# EAGLE design Board5 (EAGLE 6.1)
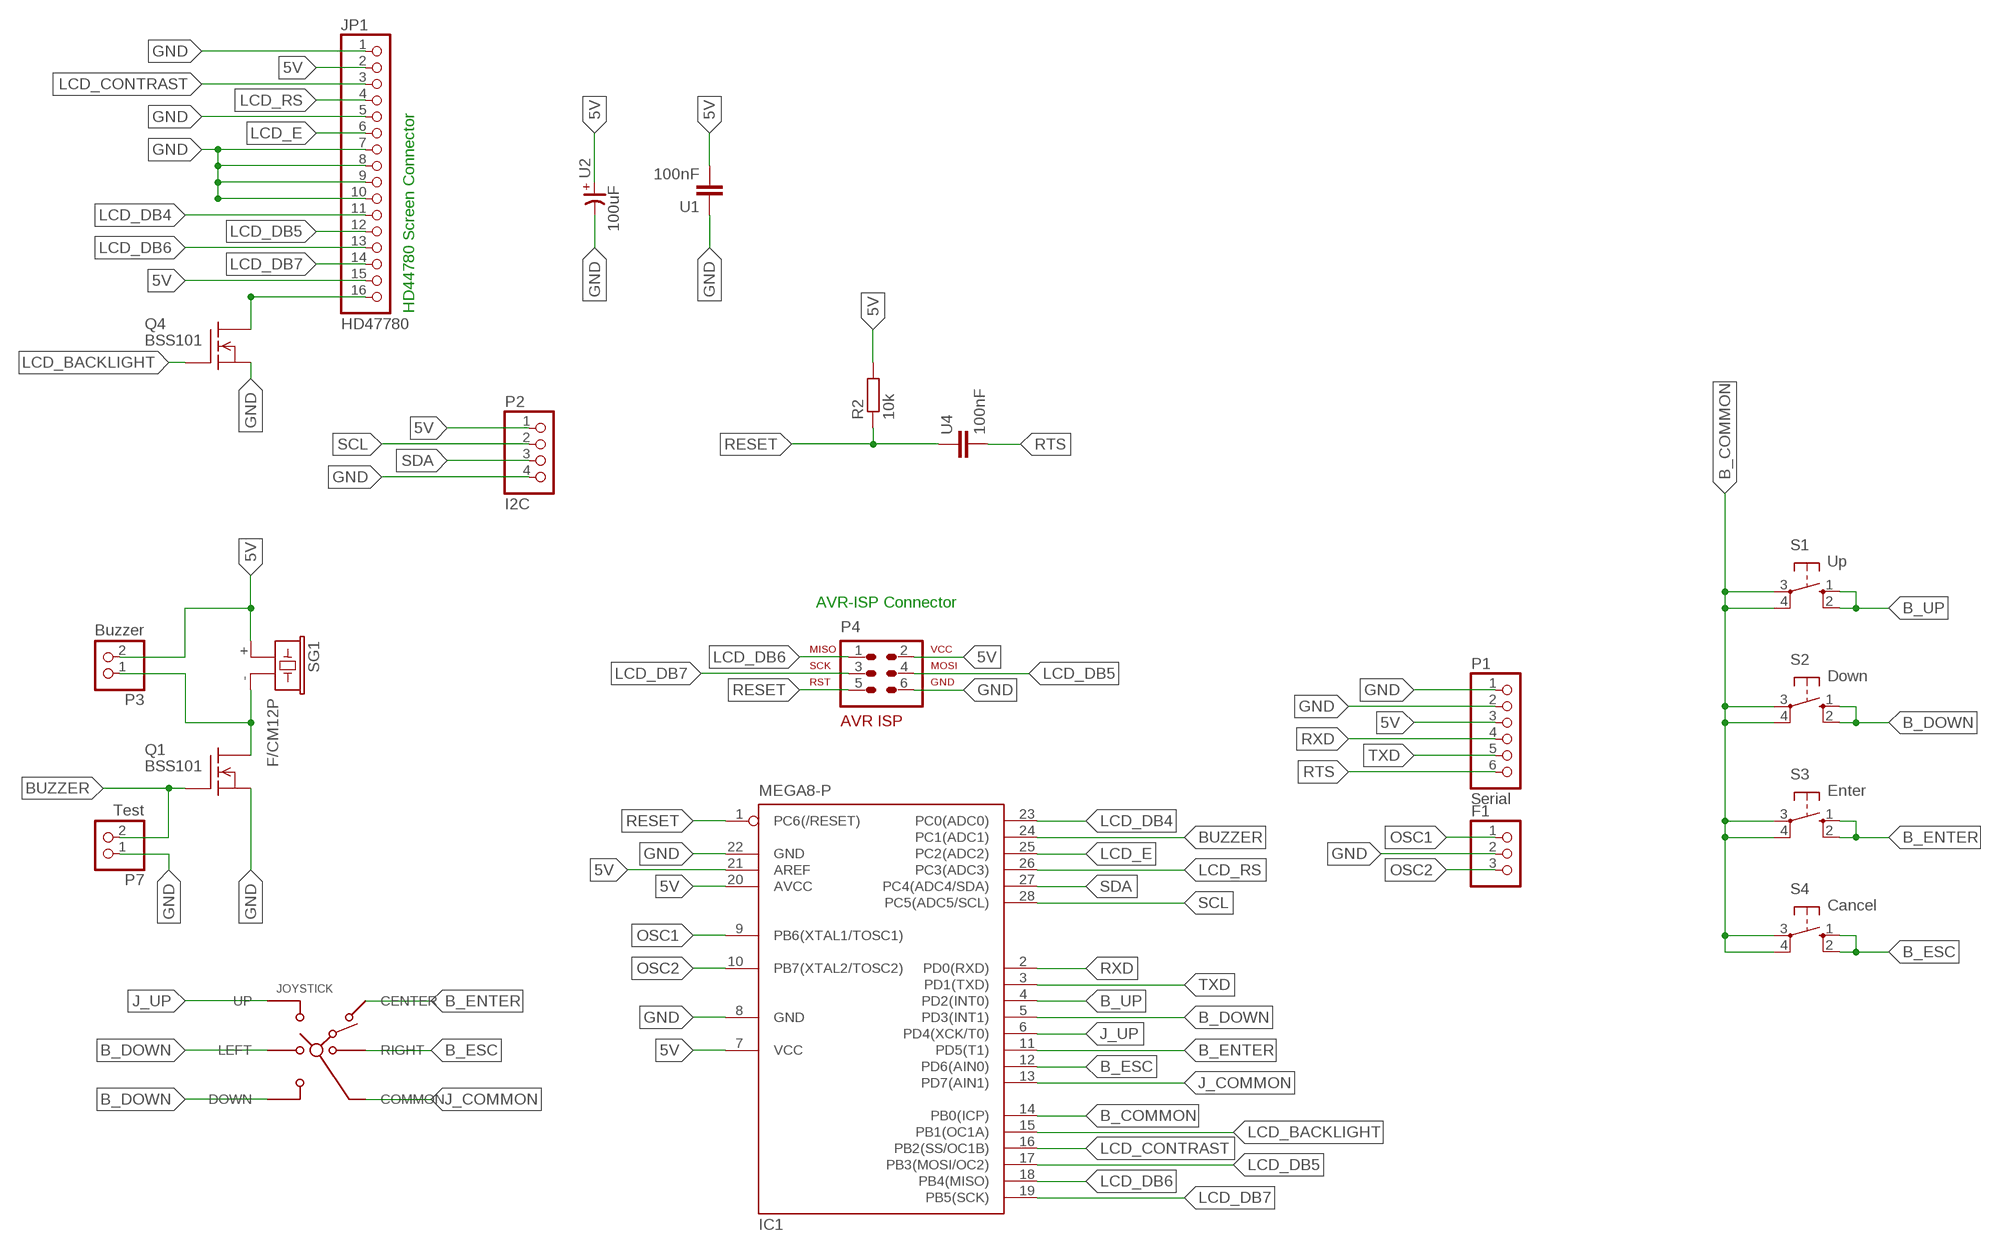
[diagram p0: schematic, sheet 1]

## Parts
F1  PINHD-1X3  [1X03]
IC1  MEGA8-P  [DIL28-3]
JOYSTICK  SKQUAAA010  [SKQU]
JP1  HD47780  PINHD-1X16  [1X16]
P1  Serial  PINHD-1X6  [1X06]
P2  I2C  PINHD-1X4  [1X04]
P3  Buzzer  PINHD-1X2  [1X02]
P4  ISP_WANNENBUCHSE  [ML6]
P7  Test  PINHD-1X2  [1X02]
Q1  BSS101  [TO92]
Q4  BSS101  [TO92]
R2  10k  R-EU_0207/10  [0207/10]
S1  Up  40-XX  [B3F-40XX]
S2  Down  40-XX  [B3F-40XX]
S3  Enter  40-XX  [B3F-40XX]
S4  Cancel  40-XX  [B3F-40XX]
SG1  F/CM12P  [F/CM12P]
U1  100nF  C-EU050-024X044  [C050-024X044]
U2  100uF  CP-E-020X050  [E-020X050]
U4  100nF  C-EU050-024X044  [C050-024X044]

## Nets
5V: IC1.7(VCC) IC1.20(AVCC) IC1.21(AREF) JP1.2 JP1.15 P1.3 P2.1 P3.2 P4.2(VCC) R2.2 SG1.+ U1.2 U2.+
B_COMMON: IC1.14(PB0(ICP)) S1.3(P) S1.4(P1) S2.3(P) S2.4(P1) S3.3(P) S3.4(P1) S4.3(P) S4.4(P1)
B_DOWN: IC1.5(PD3(INT1)) JOYSTICK.DOWN JOYSTICK.LEFT S2.1(S) S2.2(S1)
B_ENTER: IC1.11(PD5(T1)) JOYSTICK.CENTER S3.1(S) S3.2(S1)
B_ESC: IC1.12(PD6(AIN0)) JOYSTICK.RIGHT S4.1(S) S4.2(S1)
B_UP: IC1.4(PD2(INT0)) S1.1(S) S1.2(S1)
BUZZER: IC1.24(PC1(ADC1)) P7.2 Q1.2(G)
GND: F1.2 IC1.8(GND) IC1.22(GND) JP1.1 JP1.5 JP1.7 JP1.8 JP1.9 JP1.10 P1.1 P1.2 P2.4 P4.6(GND) P7.1 Q1.1(S) Q4.1(S) U1.1 U2.-
J_COMMON: IC1.13(PD7(AIN1)) JOYSTICK.COMMON
J_UP: IC1.6(PD4(XCK/T0)) JOYSTICK.UP
LCD_BACKLIGHT: IC1.15(PB1(OC1A)) Q4.2(G)
LCD_CONTRAST: IC1.16(PB2(SS/OC1B)) JP1.3
LCD_DB4: IC1.23(PC0(ADC0)) JP1.11
LCD_DB5: IC1.17(PB3(MOSI/OC2)) JP1.12 P4.4(MOSI)
LCD_DB6: IC1.18(PB4(MISO)) JP1.13 P4.1(MISO)
LCD_DB7: IC1.19(PB5(SCK)) JP1.14 P4.3(SCK)
LCD_E: IC1.25(PC2(ADC2)) JP1.6
LCD_RS: IC1.26(PC3(ADC3)) JP1.4
N$2: JP1.16 Q4.3(D)
N$4: P3.1 Q1.3(D) SG1.-
OSC1: F1.1 IC1.9(PB6(XTAL1/TOSC1))
OSC2: F1.3 IC1.10(PB7(XTAL2/TOSC2))
RESET: IC1.1(PC6(/RESET)) P4.5(RST) R2.1 U4.1
RTS: P1.6 U4.2
RXD: IC1.2(PD0(RXD)) P1.4
SCL: IC1.28(PC5(ADC5/SCL)) P2.2
SDA: IC1.27(PC4(ADC4/SDA)) P2.3
TXD: IC1.3(PD1(TXD)) P1.5

## Notes on the sheet
- HD44780 Screen Connector
- AVR-ISP Connector

## Library data of the parts
F1 = pinhead:PINHD-1X3: PIN HEADER
IC1 = atmel:MEGA8-P: MICROCONTROLLER 8 Kbytes FLASH, 1 kbytes SRAM, 512 bytes EEPROM, USART, 4-channel 10 bit ADC, 2-channel 8 bit ADC Pin compatible with Atmega48, ATMega88, ATMega168 Source: avr.lbr; OC_FARNELL: unknown; OC_NEWARK: unknown
JOYSTICK = gamaral:SKQU: Multi Control Devices TACT Switch - 4-directional with Center Push Type. SKQU Series.; MF: ALPS; OC_MOUSER: 688-SKQUAA; OC_NEWARK: 59M1981
JP1 = pinhead:PINHD-1X16: PIN HEADER
P1 = pinhead:PINHD-1X6: PIN HEADER
P2 = pinhead:PINHD-1X4: PIN HEADER
P3 P7 = pinhead:PINHD-1X2: PIN HEADER
P4 = supa:ISP_WANNENBUCHSE
Q1 Q4 = transistor-fet:BSS101: N-Channel Enhancement MOSFET 200V; 0,16A; 11Ohm
R2 = resistor:R-EU_: RESISTOR, European symbol
S1-S4 = switch-omron:40-XX: OMRON SWITCH
SG1 = buzzer:F/CM12P: BUZZER Source: Buerklin; OC_FARNELL: unknown; OC_NEWARK: unknown
U1 U4 = resistor:C-EU: CAPACITOR, European symbol
U2 = cap-master:CP-: POLARIZED CAP

## Board
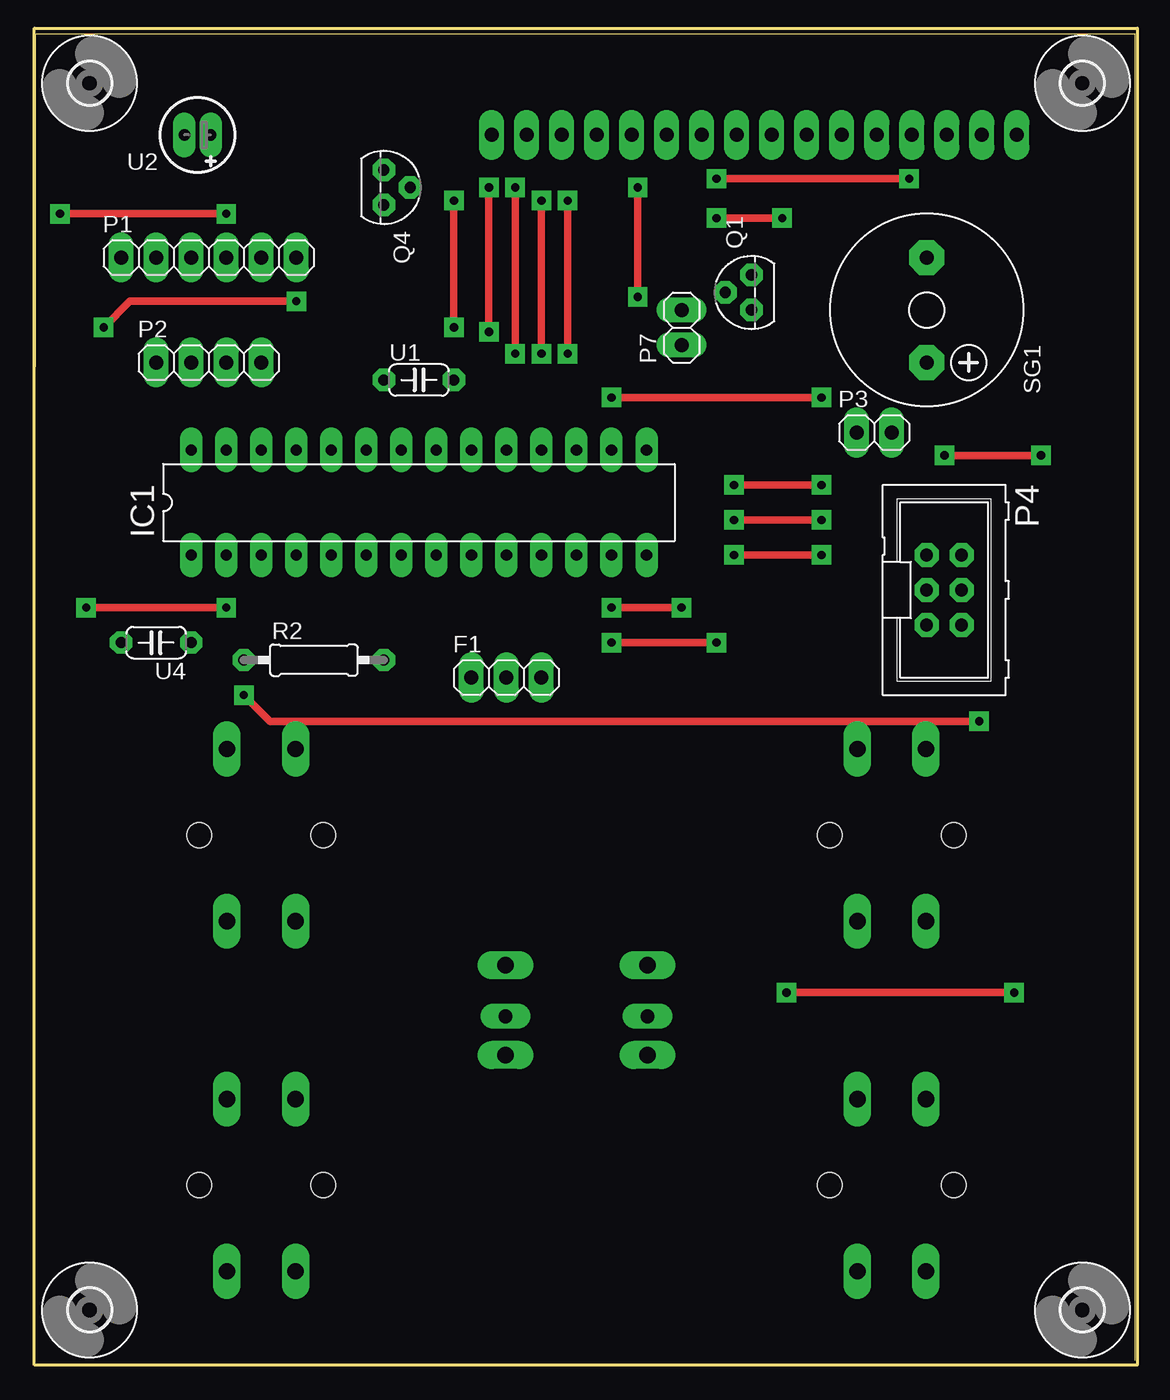
[diagram p1: board, top side]
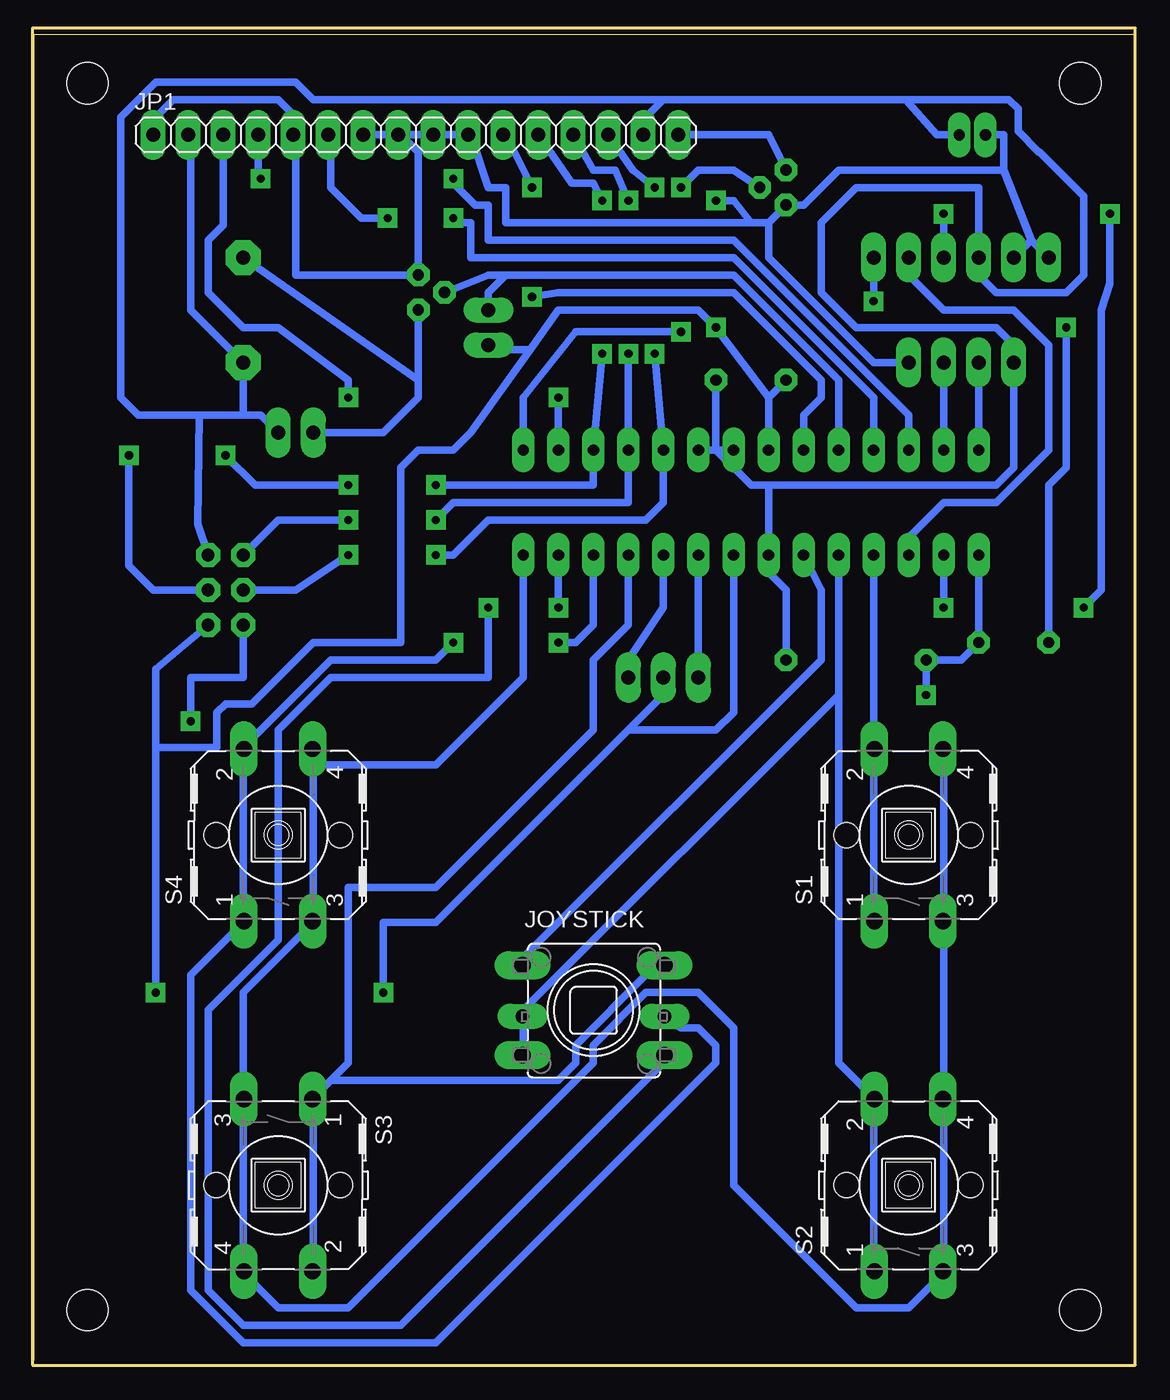
[diagram p2: board, bottom side, seen from below]

Size 79.85 x 96.54 mm. Coordinates in mm from the lower left corner, seen from the top.
Outline: 79.85,0.35 79.85,96.54 0.05,96.54 0,0
Copper layers (1*16): Top 0.035mm / dielectric 1.5mm / Bottom 0.035mm
Design rules: minimum track width 16mil, minimum drill 24mil, track to track 16mil, track to pad 16mil, pad to pad 16mil, via to via 16mil, smd to smd 8mil, copper to edge 40mil, drill to drill 16mil, minimum pad ring 16mil, minimum via ring 16mil, stop-mask expansion 4mil, vias tented up to drill 0mil, thermal gap 10mil
Milling: 4 lines

### Footprints (pad centres in the part's own frame; a part is rotated, then mirrored left to right if it is on the bottom)
1X03 = drill 1.016 long: 1 -2.54,0; 2 0,0; 3 2.54,0
DIL28-3 = drill 0.813 long: 1 -16.51,-3.81; 2 -13.97,-3.81; 3 -11.43,-3.81; 4 -8.89,-3.81; 5 -6.35,-3.81; 6 -3.81,-3.81; 7 -1.27,-3.81; 8 1.27,-3.81; 9 3.81,-3.81; 10 6.35,-3.81; 11 8.89,-3.81; 12 11.43,-3.81; 13 13.97,-3.81; 14 16.51,-3.81; 15 16.51,3.81; 16 13.97,3.81; 17 11.43,3.81; 18 8.89,3.81; 19 6.35,3.81; 20 3.81,3.81; 21 1.27,3.81; 22 -1.27,3.81; 23 -3.81,3.81; 24 -6.35,3.81; 25 -8.89,3.81; 26 -11.43,3.81; 27 -13.97,3.81; 28 -16.51,3.81
SKQU = drill 1.2 long: CENTER 5.15,3.25; COMMON 5.15,-3.25; DOWN -5.15,-3.25; UP -5.15,3.25 | drill 1 long: LEFT -5.15,-0.45; RIGHT 5.15,-0.45
1X16 = drill 1.016 long: 1 -19.05,0; 2 -16.51,0; 3 -13.97,0; 4 -11.43,0; 5 -8.89,0; 6 -6.35,0; 7 -3.81,0; 8 -1.27,0; 9 1.27,0; 10 3.81,0; 11 6.35,0; 12 8.89,0; 13 11.43,0; 14 13.97,0; 15 16.51,0; 16 19.05,0
1X06 = drill 1.016 long: 1 -6.35,0; 2 -3.81,0; 3 -1.27,0; 4 1.27,0; 5 3.81,0; 6 6.35,0
1X04 = drill 1.016 long: 1 -3.81,0; 2 -1.27,0; 3 1.27,0; 4 3.81,0
1X02 = drill 1.016 long: 1 -1.27,0; 2 1.27,0
ML6 = drill 0.914 octagon: 1 -2.54,-1.27; 2 -2.54,1.27; 3 0,-1.27; 4 0,1.27; 5 2.54,-1.27; 6 2.54,1.27
TO92 = drill 0.813 octagon: 1 1.27,0; 2 0,1.905; 3 -1.27,0
0207/10 = drill 0.813 octagon: 1 -5.08,0; 2 5.08,0
B3F-40XX = drill 1.194 long: 1 -6.248,2.489; 2 6.248,2.489; 3 -6.248,-2.489; 4 6.248,-2.489 | hole 1.803: 0,-4.496; 0,4.496
F/CM12P = drill 1.016 pad 2.54 octagon: + 3.81,0; - -3.81,0
C050-024X044 = drill 0.813 octagon: 1 -2.54,0; 2 2.54,0
E-020X050 = drill 0.813 long: + -0.953,0; - 0.953,0
3,0 = hole 3: 0,0

### Placement (x,y rotation side)
F1  34.23,49.88 0 top
IC1  27.88,62.58 0 top
JOYSTICK  39.31,25.75 0 bottom
JP1  52.2,89.25 0 bottom
P1  12.64,80.36 0 top
P2  12.64,72.74 0 top
P3  60.9,67.66 0 top
P4  65.98,56.23 270 top
P7  46.93,75.28 90 top
Q1  52.01,77.82 90 top
Q4  25.34,85.44 270 top
R2  20.26,51.15 0 top
S1  16.45,38.45 90 bottom
S2  16.45,13.05 90 bottom
S3  62.17,13.05 270 bottom
S4  62.17,38.45 90 bottom
SG1  64.71,76.55 270 top
U1  27.88,71.47 0 top
U2  11.83,89.25 180 top
U4  8.83,52.42 180 top
U$1  [3,0]  4,93 0 top
U$2  [3,0]  76,93 0 top
U$3  [3,0]  76,4 0 top
U$4  [3,0]  4,4 0 top

### Tracks (layer width: path | path; a pad name or v marks a point on that pad's centre or on a via)
5V
  Bottom 0.559: JP1.2 68.52,89.25 68.52,76.55 SG1.+ 64.71,68.93 | 34.23,91.79 35.5,90.52 35.5,89.25 JP1.15 | R2.2 25.34,56.23 26.61,57.5 IC1.7 26.61,63.85 | IC1.20 30.42,66.39 | 30.42,66.39 IC1.21 | 30.42,66.39 U1.2 | 26.61,63.85 27.88,63.85 30.42,66.39 | 26.61,63.85 10.1,63.85 8.83,65.12 P2.1 8.83,74.01 10.1,75.28 20.26,75.28 22.8,77.82 22.8,82.9 20.26,85.44 11.37,85.44 P1.3 11.37,79.09 10.1,77.82 5.02,77.82 3.75,79.09 3.75,84.81 6.95,88 7,88 8.51,89.51 8.51,91.16 9.2,91.79 16.64,91.79 | U2.+ 14.42,89.25 16.64,91.79 | 16.64,91.79 34.23,91.79 | 34.23,91.79 59.63,91.79 60.9,93.06 71.06,93.06 73.6,90.52 73.6,70.2 72.33,68.93 67.89,68.93 | 64.71,68.93 67.89,68.93 | 67.89,68.93 68,61 P4.2 | P3.2 63.44,68.93 64.71,68.93
B_COMMON
  Bottom 0.559: S1.4 13.91,43.53 13.91,33.37 S1.3 13.91,32.1 13.91,19.4 S2.4 13.91,18.13 13.91,7.97 S2.3 13.91,6.7 16.45,4.16 20.26,4.16 29.15,13.05 29.15,24.48 31.69,27.02 35.5,27.02 39.31,23.21 39.31,21.94 57.09,4.16 62.17,4.16 64.71,6.7 S3.4 64.71,7.97 64.71,18.13 S3.3 64.71,19.4 64.71,27.02 59.63,32.1 S4.3 59.63,33.37 59.63,43.53 | 59.63,43.53 50.74,43.53 44.39,49.88 IC1.14 | 59.63,43.53 S4.4
B_DOWN
  Bottom 0.559: JOYSTICK.DOWN 44.39,23.21 44.39,24.48 JOYSTICK.LEFT 44.39,25.75 21.53,48.61 | 21.53,48.61 21.53,21.94 18.99,19.4 S2.2 18.99,18.13 18.99,7.97 S2.1 | 21.53,48.61 IC1.5
B_ENTER
  Bottom 0.559: IC1.11 36.77,53.69 39.31,51.15 39.31,46.07 50.74,34.64 57.09,34.64 57.09,21.94 58.36,20.67 | 58.36,20.67 59.63,19.4 S3.1 59.63,18.13 59.63,7.97 S3.2 | 58.36,20.67 41.85,20.67 40.58,21.94 40.58,23.21 35.5,28.29 34.23,28.29 JOYSTICK.CENTER
B_ESC  (via drill 0.6)
  Top 0.559: v41.85,52.42 v49.47,52.42
  Bottom 0.559: JOYSTICK.RIGHT 32.96,24.48 31.69,24.48 30.42,23.21 30.42,21.94 50.74,1.62 64.71,1.62 68.52,5.43 68.52,28.29 64.71,32.1 S4.1 64.71,33.37 64.71,43.53 S4.2 64.71,44.8 58.36,51.15 50.74,51.15 v49.47,52.42 | IC1.12 39.31,53.69 40.58,52.42 v41.85,52.42
B_UP
  Bottom 0.559: IC1.4 18.99,44.8 S1.2 18.99,43.53 18.99,33.37 S1.1
BUZZER
  Bottom 0.559: IC1.24 21.53,71.47 29.15,79.09 45.66,79.09 | Q1.2 46.93,79.09 45.66,79.09 | 45.66,79.09 46.93,77.82 P7.2
GND  (via drill 0.6)
  Top 0.559: v54.55,27.02 v71.06,27.02 | v30.42,75.28 v30.42,84.49
  Bottom 0.559: JP1.8 JP1.7 | 60.9,89.25 60.9,79.09 Q1.1 52.01,87.98 53.28,89.25 JP1.8 | 7.56,81.63 9.56,86.71 | P1.1 7.56,81.63 | 7.56,81.63 P1.2 | P2.4 18.99,72.74 26.61,80.36 26.61,82.9 | 26.61,82.9 Q4.1 24.07,84.17 21.53,86.71 9.56,86.71 | 26.61,82.9 27.88,82.9 | 27.88,82.9 45.66,82.9 45.66,85.44 46.93,85.44 48.2,89.25 JP1.10 JP1.9 JP1.8 | 26.61,70.2 IC1.22 | U1.1 26.61,70.2 | P4.6 71.06,50.5 71.06,44.8 | 26.61,70.2 v30.42,75.28 31.69,76.55 41.85,76.55 43.91,73.67 | 43.91,73.67 48.2,67.66 49.47,66.39 52.01,66.39 53.28,65.12 53.28,52.42 59.63,52.42 64.08,47.98 65.98,47.98 66.61,47.34 66.61,44.8 71.06,44.8 | 60.9,89.25 60.9,90.52 62.17,91.79 69.79,91.79 71.06,90.52 71.06,89.25 | 60.9,89.25 JP1.5 | 71.06,89.25 JP1.1 | U2.- 9.56,89.25 9.56,86.71 | F1.2 34.23,48.61 36.77,46.07 | 36.77,46.07 50.74,32.1 54.55,32.1 v54.55,27.02 | v71.06,27.02 71.06,44.8 | IC1.8 29.15,47.34 30.42,46.07 36.77,46.07 | P7.1 46.59,73.67 43.91,73.67 | 71.06,89.25 71,89.25 | v30.42,84.49 29.15,84.49 27.88,82.9
J_COMMON  (via drill 0.6)
  Top 0.559: v41.85,54.96 v46.93,54.96
  Bottom 0.559: JOYSTICK.COMMON 34.23,21.94 53.28,2.89 64.71,2.89 67.25,5.43 67.25,25.75 62.17,30.83 62.17,46.07 58.36,49.88 46.93,49.88 v46.93,54.96 | IC1.13 v41.85,54.96
J_UP
  Bottom 0.559: IC1.6 22.8,56.23 22.8,51.15 44.39,29.56 JOYSTICK.UP
LCD_BACKLIGHT  (via drill 0.6)
  Top 0.559: v32.96,74.96 v32.96,85.44
  Bottom 0.559: IC1.15 44.39,70.2 40.58,74.96 v32.96,74.96 | v32.96,85.44 31.69,86.71 29.15,86.71 Q4.2
LCD_CONTRAST  (via drill 0.6)
  Top 0.559: v41.85,70.2 v57.09,70.2
  Bottom 0.559: JP1.3 66.17,82.71 67.25,81.63 67.25,77.82 64.71,75.28 62.17,75.28 57.09,71.47 v57.09,70.2 | IC1.16 v41.85,70.2
LCD_DB4  (via drill 0.6)
  Top 0.559: v43.75,77.5 v43.75,85.44
  Bottom 0.559: IC1.23 24.07,68.93 22.8,70.2 22.8,71.47 29.15,77.82 41.85,77.82 v43.75,77.5 | v43.75,85.44 45.66,89.25 JP1.11
LCD_DB5  (via drill 0.6)
  Top 0.559: v38.67,73.38 v38.67,84.49 | v50.74,63.85 v57.09,63.85 | v66,66 v73,66
  Bottom 0.559: v38.67,73.38 IC1.17 39.31,63.85 v50.74,63.85 | v38.67,84.49 39.31,85.76 40.9,85.76 JP1.12 | v57.09,63.85 63.85,63.85 v66,66 | v73,66 73,58 71.23,56.23 P4.4
LCD_DB6  (via drill 0.6)
  Top 0.559: v36.77,73.38 v36.77,84.49 | v50.74,61.31 v57.09,61.31
  Bottom 0.559: v36.77,73.38 IC1.18 36.77,62.58 49.47,62.58 v50.74,61.31 | v36.77,84.49 37.72,86.71 39.31,86.71 JP1.13 | v57.09,61.31 62.17,61.31 P4.1
LCD_DB7  (via drill 0.6)
  Top 0.559: v34.87,73.38 v34.87,85.44 | v50.74,58.77 v57.09,58.77
  Bottom 0.559: v34.87,73.38 IC1.19 34.23,62.58 35.5,61.31 46.93,61.31 49.47,58.77 v50.74,58.77 | v34.87,85.44 36.45,86.71 JP1.14 | v57.09,58.77 60.9,56.23 P4.3
LCD_E  (via drill 0.6)
  Top 0.559: v49.47,83.22 v54.23,83.22
  Bottom 0.559: IC1.25 18.99,70.2 29.15,80.36 48.2,80.36 48.2,82.9 49.15,82.9 v49.47,83.22 | v54.23,83.22 56.14,83.22 58.36,85.44 58.36,89.06 JP1.6
LCD_RS  (via drill 0.6)
  Top 0.559: v63.44,86.08 v49.47,86.08
  Bottom 0.559: IC1.26 16.45,68.93 29.15,81.63 46.93,81.63 46.93,84.17 47.88,84.17 49.47,85.76 v49.47,86.08 | JP1.4 63.63,86.27 v63.44,86.08
N$2
  Bottom 0.559: Q4.3 26.61,89.25 JP1.16
N$4
  Bottom 0.559: 52.01,71.47 Q1.3 | 52.01,71.47 SG1.- | 52.01,71.47 52.01,70.2 54.55,67.66 P3.1
OSC1
  Bottom 0.559: F1.1 IC1.9
OSC2
  Bottom 0.559: IC1.10 34.23,54.96 36.77,51.15 F1.3
RESET  (via drill 0.6)
  Top 0.559: v68.52,46.7 17.09,46.7 v15.18,48.61
  Bottom 0.559: IC1.1 U4.1 12.64,51.15 R2.1 v15.18,48.61 | P4.5 64.71,49.88 68.52,49.88 v68.52,46.7
RTS  (via drill 0.6)
  Top 0.559: v5.02,75.28 6.92,77.19 v18.99,77.19
  Bottom 0.559: U4.2 6.29,63.85 5.02,65.12 v5.02,75.28 | v18.99,77.19 P1.6
RXD  (via drill 0.6)
  Top 0.559: v13.91,54.96 v3.75,54.96 | v1.84,83.53 v13.91,83.53
  Bottom 0.559: IC1.2 v13.91,54.96 | v3.75,54.96 2.48,56.23 2.48,76.55 1.84,78.45 v1.84,83.53 | v13.91,83.53 P1.4
SCL
  Bottom 0.559: P2.2 IC1.28
SDA
  Bottom 0.559: P2.3 IC1.27
TXD
  Bottom 0.559: IC1.3 16.45,60.04 13.91,62.58 10.1,62.58 6.29,66.39 6.29,74.01 8.83,76.55 13.91,76.55 16.45,79.09 P1.5